# EAGLE design midi (EAGLE 7.1.0)
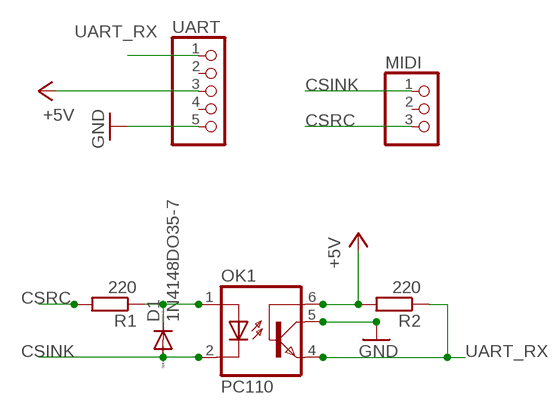
[diagram p0: schematic, sheet 1]

## Parts
D1  1N4148DO35-7  [DO35-7]
MIDI  PINHD-1X3  [1X03]
OK1  PC110  [DIL06]
R1  220  R-EU_0309/V  [0309V]
R2  220  R-EU_0309/V  [0309V]
UART  PINHD-1X5  [1X05]

## Nets
+5V: OK1.6(BAS) R2.2 UART.3
CSINK: D1.A MIDI.1 OK1.2(C)
CSRC: MIDI.3 R1.2
GND: OK1.5(COL) UART.5
N$1: D1.C OK1.1(A) R1.1
UART_RX: OK1.4(EMI) R2.1 UART.1
Unconnected: MIDI.2 UART.2 UART.4

## Library data of the parts
D1 = diode:1N4148: DIODE high speed (Philips)
MIDI = pinhead:PINHD-1X3: PIN HEADER
OK1 = optocoupler:PC110: SHARP OPTO COUPLER; OC_FARNELL: unknown; OC_NEWARK: unknown
R1 R2 = rcl:R-EU_: RESISTOR, European symbol
UART = pinhead:PINHD-1X5: PIN HEADER

## Board
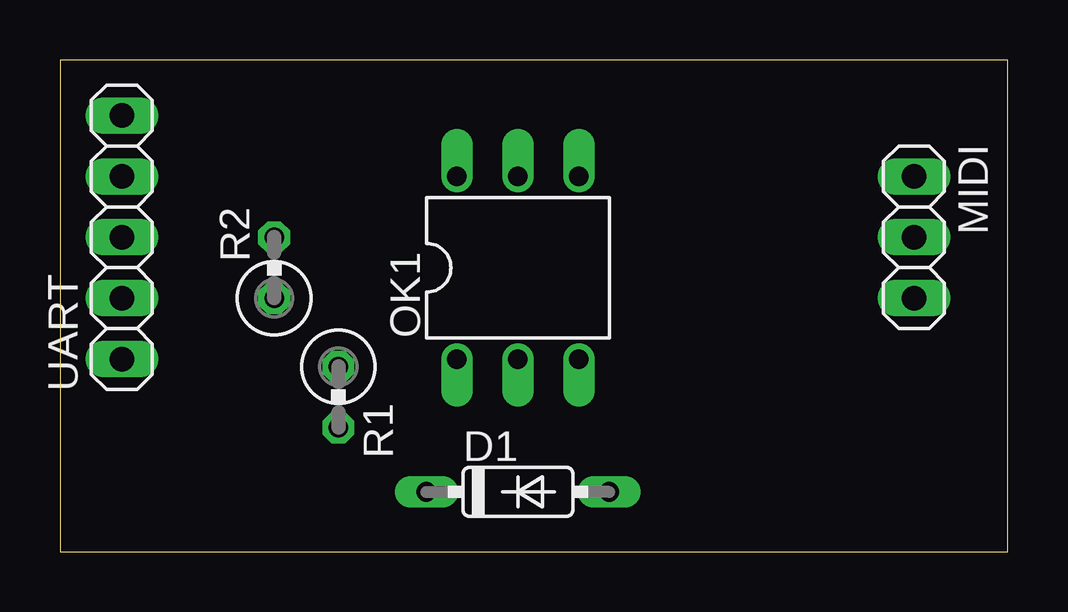
[diagram p1: board, top side]
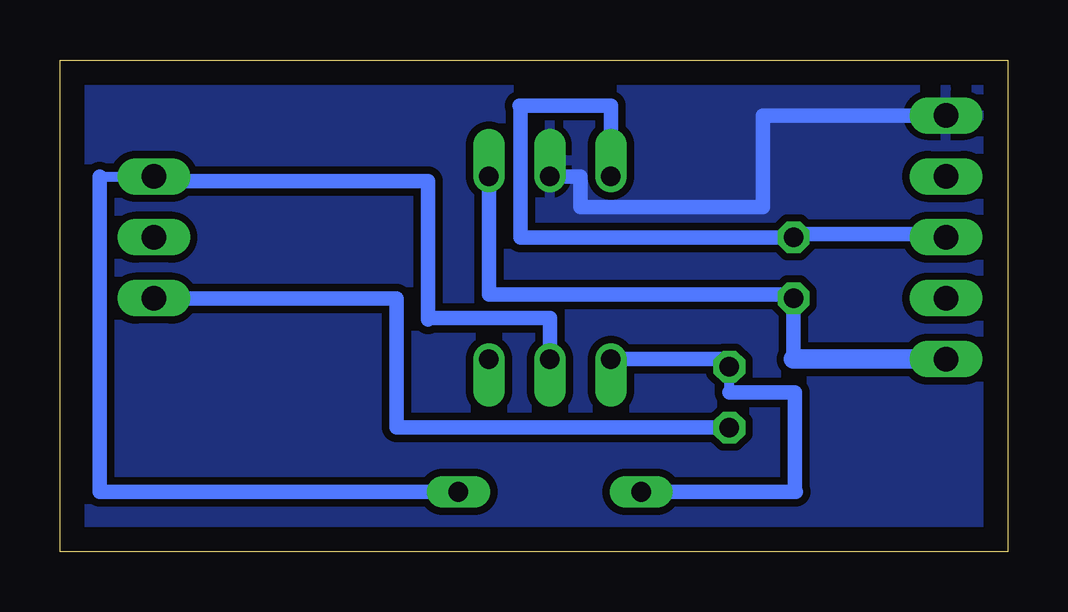
[diagram p2: board, bottom side, seen from below]

Size 39.51 x 20.51 mm. Coordinates in mm from the lower left corner, seen from the top.
Outline: 0,0 39.51,0 39.51,20.51 0,20.51 0,0
Copper layers (1*16): Top 0.035mm / dielectric 1.5mm / Bottom 0.035mm
Design rules "default *": minimum track width 10mil, minimum drill 24mil, track to track 12mil, track to pad 12mil, pad to pad 12mil, via to via 12mil, smd to smd 8mil, copper to edge 40mil, drill to drill 8mil, minimum pad ring 10mil, minimum via ring 8mil, stop-mask expansion 4mil, vias tented up to drill 0mil, thermal gap 10mil

### Footprints (pad centres in the part's own frame; a part is rotated, then mirrored left to right if it is on the bottom)
DO35-7 = drill 0.813 long: A 3.81,0; C -3.81,0
1X03 = drill 1.016 long: 1 -2.54,0; 2 0,0; 3 2.54,0
DIL06 = drill 0.813 offset: 1 -2.54,-3.81; 2 0,-3.81; 3 2.54,-3.81; 4 2.54,3.81; 5 0,3.81; 6 -2.54,3.81
0309V = drill 0.813 octagon: 1 -1.27,0; 2 1.27,0
1X05 = drill 1.016 long: 1 -5.08,0; 2 -2.54,0; 3 0,0; 4 2.54,0; 5 5.08,0

### Placement (x,y rotation side)
D1  19.09,2.5 0 top
MIDI  35.6,13.12 270 top
OK1  19.09,11.85 0 top
R1  11.61,6.45 270 top
R2  8.93,11.85 90 top
UART  2.58,13.12 90 top

### Tracks (layer width: path | path; a pad name or v marks a point on that pad's centre or on a via)
+5V
  Bottom 0.254: 8.73,13.24 R2.2 | 2.78,13.24 UART.3
  Bottom 0.406: OK1.6 | 20.35,18.6 20.35,18.46 20.31,18.46 | 8.93,13.1 R2.2
  Bottom 0.61: 2.78,13.24 8.73,13.24 | OK1.6 16.55,18.6 20.35,18.6 | 20.31,18.46 20.31,13.1 8.93,13.1
CSINK
  Bottom 0.406: OK1.2 | 23.94,9.75 23.94,9.7 24.16,9.7 | 35.6,15.46 MIDI.1 35.6,15.65 37.86,15.65
  Bottom 0.61: OK1.2 19.08,9.75 23.94,9.75 | 24.16,9.7 24.16,15.46 35.6,15.46 | D1.A 37.86,2.5 37.86,15.65
CSRC
  Bottom 0.406: 35.6,10.56 MIDI.3
  Bottom 0.61: R1.2 25.48,5.18 25.48,10.56 35.6,10.56
GND
  Bottom 0.61: OK1.5 17.82,15.66 17.82,14.39 10.2,14.39 10.2,18.2 UART.5
  pour Bottom: 0.76,19.78 38.77,19.78 38.77,0.85 0.49,0.76 0.49,19.91
N$1
  Bottom 0.406: 8.84,2.5 8.84,2.71 8.88,2.71 | 11.61,6.66 R1.1 11.61,8.04
  Bottom 0.61: D1.C 8.84,2.5 | 8.88,2.71 8.88,6.66 11.61,6.66 | OK1.1 11.61,8.04
UART_RX
  Bottom 0.254: 8.73,10.5 R2.1 8.96,10.73 | 2.78,8.22 UART.1
  Bottom 0.406: 8.73,10.5 8.93,10.5
  Bottom 0.61: 8.96,10.73 16.27,10.73 21.63,10.73 OK1.4 | 8.93,10.5 8.93,8.04
  Bottom 0.813: 8.93,8.04 UART.1